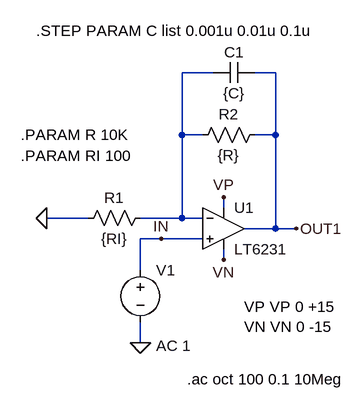
[diagram p0: schematic Fig_8-14_LowPass_Filter_AC-P.asc]
Fig_8-14_LowPass_Filter_AC-P.asc, the LTspice schematic file:
Version 4
SHEET 1 1016 680
WIRE 160 -96 112 -96
WIRE 256 -96 224 -96
WIRE 112 0 112 -96
WIRE 144 0 112 0
WIRE 256 0 256 -96
WIRE 256 0 224 0
WIRE 176 112 176 96
WIRE -32 128 -96 128
WIRE 112 128 112 0
WIRE 112 128 48 128
WIRE 144 128 112 128
WIRE 256 144 256 0
WIRE 256 144 208 144
WIRE 288 144 256 144
WIRE 80 160 48 160
WIRE 144 160 80 160
WIRE 176 192 176 176
WIRE 48 208 48 160
WIRE 48 320 48 288
FLAG 176 96 VP
FLAG 176 192 VN
FLAG -96 128 0
FLAG 288 144 OUT1
FLAG 48 320 0
FLAG 80 160 IN
SYMBOL res -48 144 R270
WINDOW 0 32 56 VTop 2
WINDOW 3 0 56 VBottom 2
SYMATTR InstName R1
SYMATTR Value {RI}
SYMBOL res 128 16 R270
WINDOW 0 32 56 VTop 2
WINDOW 3 0 56 VBottom 2
SYMATTR InstName R2
SYMATTR Value {R}
SYMBOL voltage 48 192 R0
WINDOW 123 24 132 Left 2
WINDOW 39 0 0 Left 2
SYMATTR Value2 AC 1
SYMATTR InstName V1
SYMATTR Value ""
SYMBOL cap 160 -80 R270
WINDOW 0 32 32 VTop 2
WINDOW 3 0 32 VBottom 2
SYMATTR InstName C1
SYMATTR Value {C}
SYMBOL Opamps\\LT6231 176 144 R0
SYMATTR InstName U1
TEXT 208 264 Left 2 !VP VP 0 +15\nVN VN 0 -15
TEXT 120 376 Left 2 !.ac oct 100 0.1 10Meg
TEXT -112 -160 Left 2 !.STEP PARAM C list 0.001u 0.01u 0.1u
TEXT -136 0 Left 2 !.PARAM R 10K
TEXT -136 32 Left 2 !.PARAM RI 100

The netlist it stands for:
* Fig_8-14_LowPass_Filter_AC-P.asc
R1 0 N001 {RI}
R2 N001 OUT1 {R}
V1 IN 0 AC 1
C1 N001 OUT1 {C}
XU1 IN N001 OUT1 VP VN LT6231  ; pins In+ In- OUT V+ V-
VP VP 0 +15
VN VN 0 -15
.ac oct 100 0.1 10Meg
.STEP PARAM C list 0.001u 0.01u 0.1u
.PARAM R 10K
.PARAM RI 100
.lib LTC2.lib
.backanno
.end